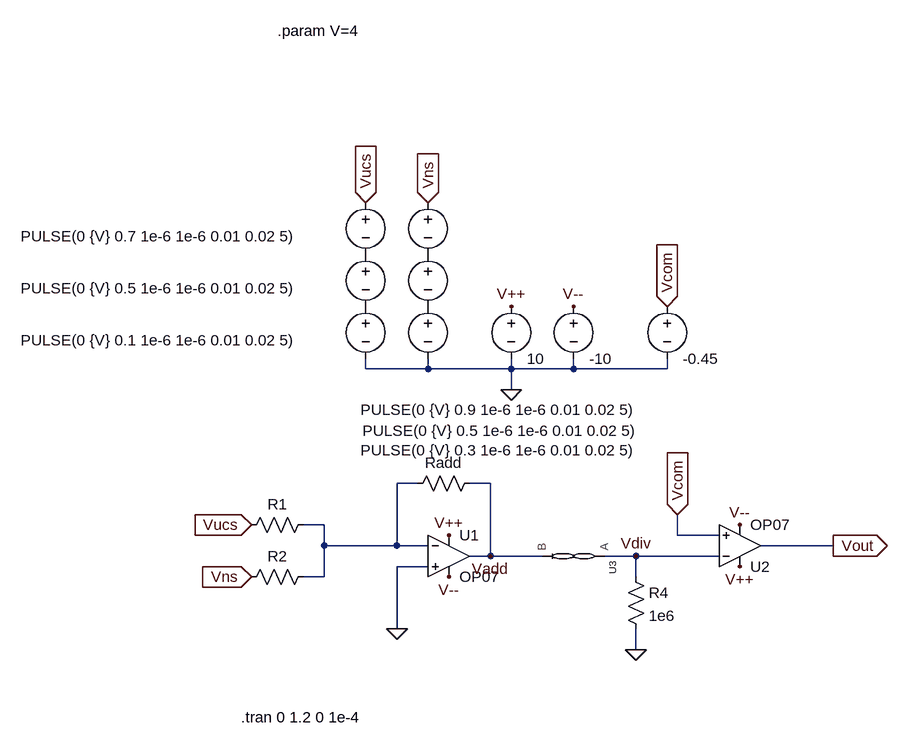
[diagram p0: schematic 学习电路.asc]
学习电路.asc, the LTspice schematic file:
Version 4
SHEET 1 1336 680
WIRE 176 -112 176 -128
WIRE 272 -112 272 -128
WIRE 272 -112 176 -112
WIRE 400 -112 400 -128
WIRE 400 -112 272 -112
WIRE 496 -112 496 -128
WIRE 496 -112 400 -112
WIRE 640 -112 640 -128
WIRE 640 -112 496 -112
WIRE 400 -80 400 -112
WIRE 256 64 224 64
WIRE 368 64 336 64
WIRE 112 128 80 128
WIRE 656 144 656 112
WIRE 720 144 656 144
WIRE 112 160 112 128
WIRE 224 160 224 64
WIRE 224 160 112 160
WIRE 272 160 224 160
WIRE 896 160 784 160
WIRE 368 176 368 64
WIRE 368 176 336 176
WIRE 448 176 368 176
WIRE 592 176 544 176
WIRE 720 176 592 176
WIRE 272 192 224 192
WIRE 112 208 112 160
WIRE 112 208 80 208
WIRE 592 208 592 176
WIRE 224 288 224 192
WIRE 592 320 592 288
FLAG 224 288 0
FLAG 592 320 0
FLAG 400 -80 0
FLAG 176 -368 Vucs
IOPIN 176 -368 In
FLAG 272 -368 Vns
IOPIN 272 -368 In
FLAG 400 -208 V++
FLAG 496 -208 V--
FLAG 640 -208 Vcom
IOPIN 640 -208 In
FLAG 368 176 Vadd
FLAG 656 112 Vcom
IOPIN 656 112 In
FLAG 592 176 Vdiv
FLAG 752 128 V--
FLAG 752 192 V++
FLAG 304 144 V++
FLAG 304 208 V--
FLAG 896 160 Vout
IOPIN 896 160 Out
FLAG 0 208 Vns
IOPIN 0 208 In
FLAG 0 128 Vucs
IOPIN 0 128 In
SYMBOL res 96 112 R90
WINDOW 0 0 56 VBottom 2
WINDOW 3 32 56 Invisible 2
SYMATTR InstName R1
SYMATTR Value 50k
SYMBOL res 96 192 R90
WINDOW 0 0 56 VBottom 2
WINDOW 3 32 56 Invisible 2
SYMATTR InstName R2
SYMATTR Value 250k
SYMBOL res 352 48 R90
WINDOW 0 0 56 VBottom 2
WINDOW 3 32 56 Invisible 2
SYMATTR InstName Radd
SYMATTR Value 50k
SYMBOL res 576 192 R0
SYMATTR InstName R4
SYMATTR Value 1e6
SYMBOL voltage 176 -224 R0
WINDOW 0 24 16 Invisible 2
WINDOW 3 -531 68 Left 2
WINDOW 123 0 0 Left 0
WINDOW 39 0 0 Left 0
SYMATTR InstName Vucs
SYMATTR Value PULSE(0 {V} 0.1 1e-6 1e-6 0.01 0.02 5)
SYMBOL voltage 272 -224 R0
WINDOW 0 24 16 Invisible 2
WINDOW 3 -104 237 Left 2
WINDOW 123 0 0 Left 0
WINDOW 39 0 0 Left 0
SYMATTR InstName Vns
SYMATTR Value PULSE(0 {V} 0.3 1e-6 1e-6 0.01 0.02 5)
SYMBOL voltage 496 -224 R0
WINDOW 0 24 16 Invisible 2
WINDOW 123 0 0 Left 0
WINDOW 39 0 0 Left 0
SYMATTR InstName V3
SYMATTR Value -10
SYMBOL voltage 400 -224 R0
WINDOW 0 24 16 Invisible 2
WINDOW 123 0 0 Left 0
WINDOW 39 0 0 Left 0
SYMATTR InstName V1
SYMATTR Value 10
SYMBOL voltage 640 -224 R0
WINDOW 0 24 16 Invisible 2
WINDOW 123 0 0 Left 0
WINDOW 39 0 0 Left 0
SYMATTR InstName V2
SYMATTR Value -0.45
SYMBOL voltage 176 -304 R0
WINDOW 0 24 16 Invisible 2
WINDOW 3 -531 68 Left 2
WINDOW 123 0 0 Left 0
WINDOW 39 0 0 Left 0
SYMATTR InstName Vucs1
SYMATTR Value PULSE(0 {V} 0.5 1e-6 1e-6 0.01 0.02 5)
SYMBOL voltage 272 -304 R0
WINDOW 0 24 16 Invisible 2
WINDOW 3 -101 287 Left 2
WINDOW 123 0 0 Left 0
WINDOW 39 0 0 Left 0
SYMATTR InstName Vns1
SYMATTR Value PULSE(0 {V} 0.5 1e-6 1e-6 0.01 0.02 5)
SYMBOL voltage 176 -384 R0
WINDOW 0 24 16 Invisible 2
WINDOW 3 -531 68 Left 2
WINDOW 123 0 0 Left 0
WINDOW 39 0 0 Left 0
SYMATTR InstName Vucs2
SYMATTR Value PULSE(0 {V} 0.7 1e-6 1e-6 0.01 0.02 5)
SYMBOL voltage 272 -384 R0
WINDOW 0 24 16 Invisible 2
WINDOW 3 -104 335 Left 2
WINDOW 123 0 0 Left 0
WINDOW 39 0 0 Left 0
SYMATTR InstName Vns2
SYMATTR Value PULSE(0 {V} 0.9 1e-6 1e-6 0.01 0.02 5)
SYMBOL OpAmps\\OP07 304 112 R0
SYMATTR InstName U1
SYMBOL OpAmps\\OP07 752 224 M180
SYMATTR InstName U2
SYMBOL memristor_neural 496 176 R90
SYMATTR InstName U3
TEXT -16 424 Left 2 !.tran 0 1.2 0 1e-4
TEXT 40 -632 Left 2 !.param V=4

The netlist it stands for:
* 学习电路.asc
R1 N001 Vucs 50k
R2 N001 Vns 250k
Radd Vadd N001 50k
R4 Vdiv 0 1e6
Vucs P001 0 PULSE(0 {V} 0.1 1e-6 1e-6 0.01 0.02 5)
Vns P002 0 PULSE(0 {V} 0.3 1e-6 1e-6 0.01 0.02 5)
V3 V-- 0 -10
V1 V++ 0 10
V2 Vcom 0 -0.45
Vucs1 P003 P001 PULSE(0 {V} 0.5 1e-6 1e-6 0.01 0.02 5)
Vns1 P004 P002 PULSE(0 {V} 0.5 1e-6 1e-6 0.01 0.02 5)
Vucs2 Vucs P003 PULSE(0 {V} 0.7 1e-6 1e-6 0.01 0.02 5)
Vns2 Vns P004 PULSE(0 {V} 0.9 1e-6 1e-6 0.01 0.02 5)
XU1 0 N001 V++ V-- Vadd LT1001  ; OP07, pins In+ In- V+ V- OUT
XU2 Vcom Vdiv V++ V-- Vout LT1001  ; OP07, pins In+ In- V+ V- OUT
XU3 Vdiv Vadd memristor_neural  ; pins A B
.tran 0 1.2 0 1e-4
.param V=4
.lib LTC.lib
.lib memristor_neural.sub
.backanno
.end

* Results of the author's LTspice run, read from the files saved beside the schematic
* Operating Point, zero values left out:
*   V(vdiv) = -2.94 mV
*   V(v--) = -10 V
*   V(v++) = 10 V
*   V(vcom) = -450 mV
*   V(vout) = -9.07 V
*   I(R4) = -2.94 nA
*   I(V3) = 4.497 mA
*   I(V1) = -4.504 mA
*   I(V2) = 6.036 nA
*   Ix(u1:3) = 2.25 mA
*   Ix(u1:4) = -2.25 mA
*   Ix(u1:5) = -3.095 nA
*   Ix(u2:1) = -6.036 nA
*   Ix(u2:2) = 6.035 nA
*   Ix(u2:3) = 2.254 mA
*   Ix(u2:4) = -2.247 mA
*   Ix(u2:5) = 18.14 pA
*   Ix(u3:PLUS) = -3.095 nA
*   Ix(u3:MINUS) = 3.095 nA
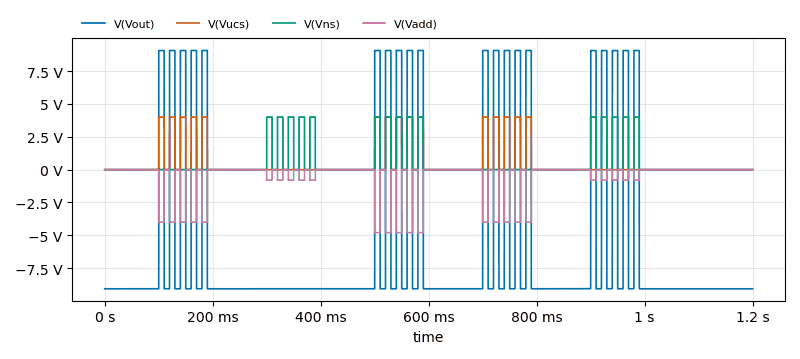
[diagram p1: Transient Analysis of 学习电路.asc, plotted from the saved traces]
* Transient Analysis, 1 run:
*   V(Vout): min -9.071 V, max 9.078 V, average -6.05 V, rms 9.064 V, last -9.07 V
*   V(Vucs): min 0 V, max 4 V, average 500.1 mV, rms 1.414 V, last 0 V
*   V(Vns): min 0 V, max 4 V, average 500.1 mV, rms 1.414 V, last 0 V
*   V(Vadd): min -4.806 V, max 5.64 mV, average -600.1 mV, rms 1.532 V, last 0 V